# EAGLE design brain_rev_1 (EAGLE 6.3)
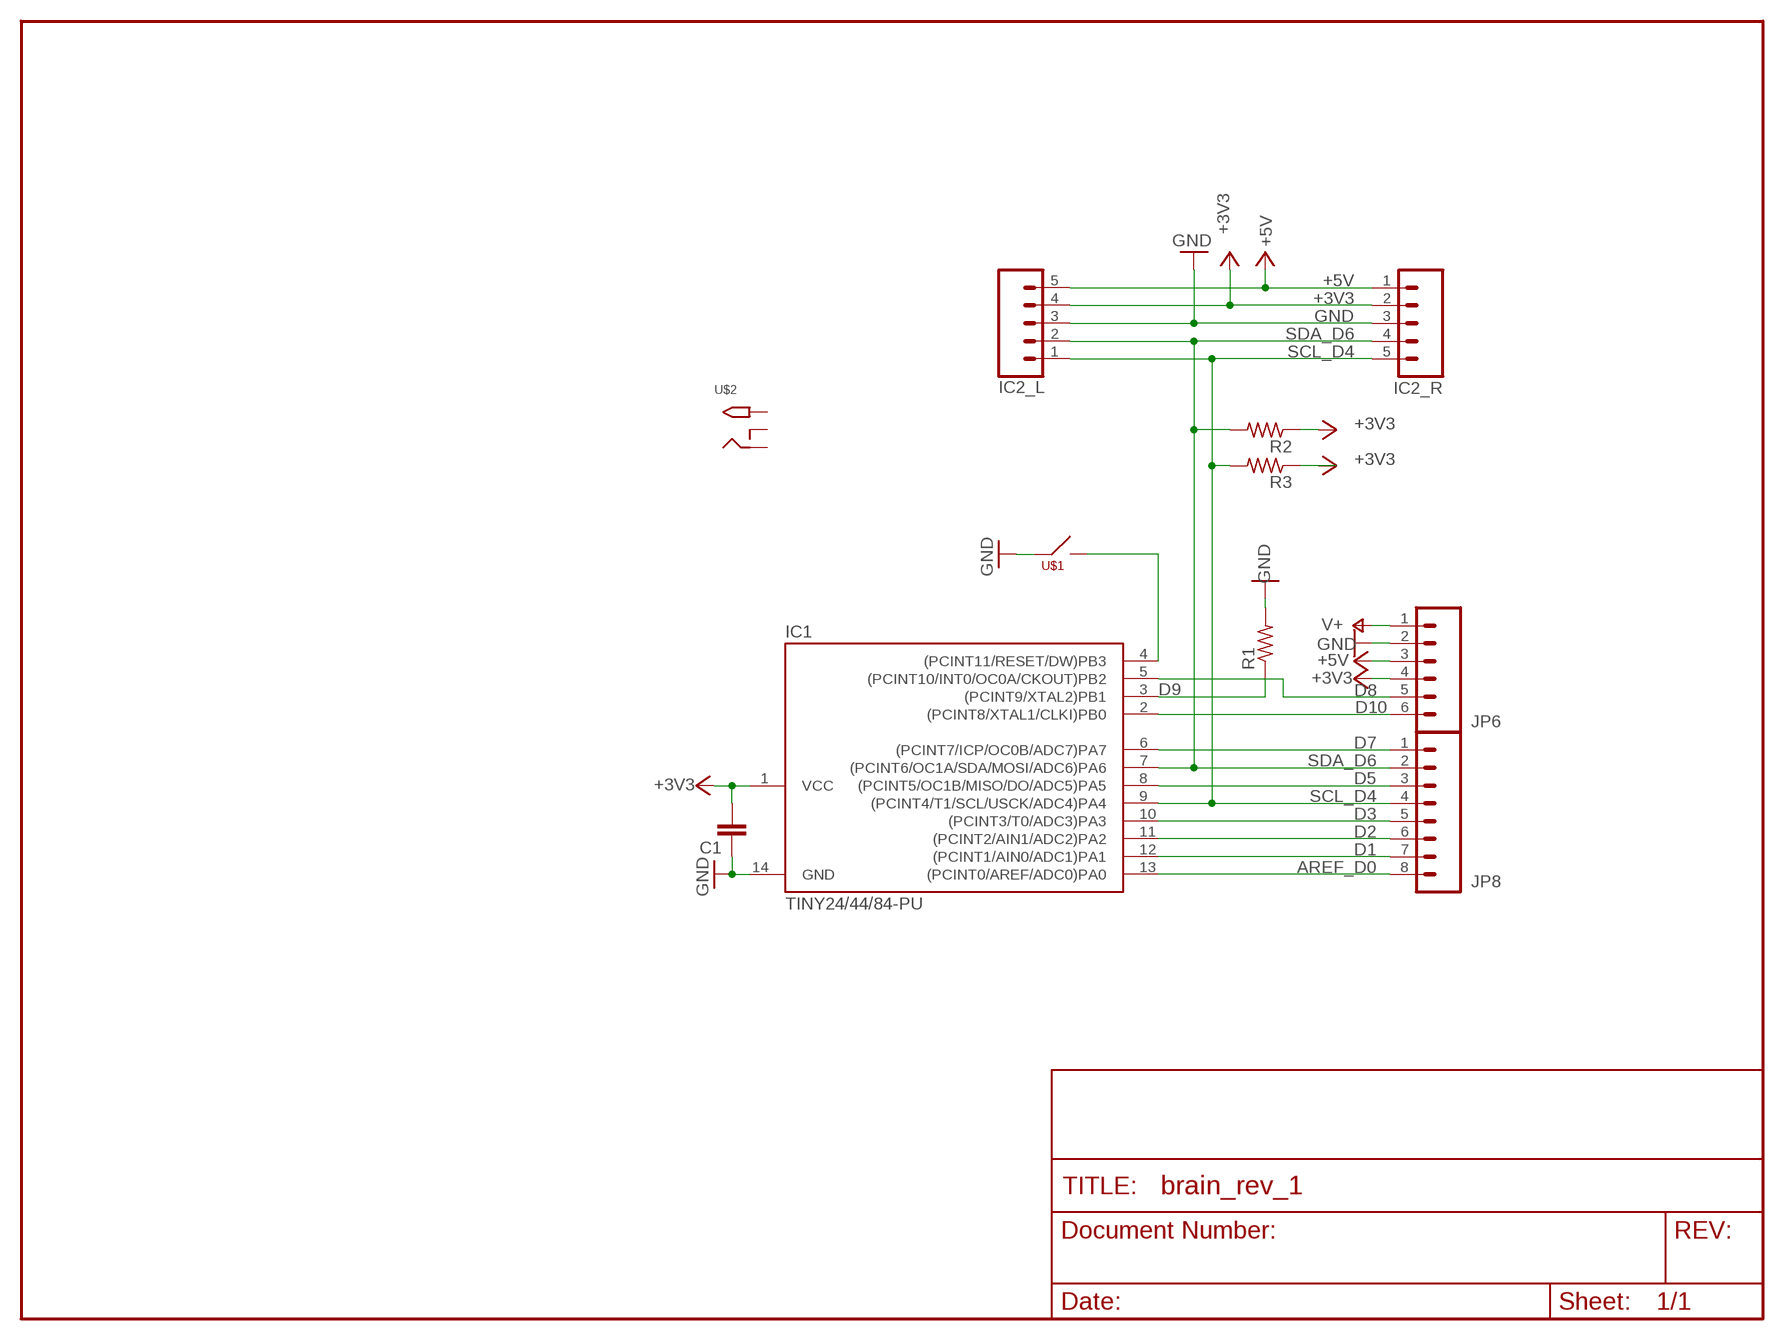
[diagram p0: schematic, sheet 1]

## Parts
C1  CAPKIT  [CAP-PTH-SMALL-KIT]
IC1  TINY24/44/84-PU  [DIL14]
IC2_L  M05PTH  [1X05]
IC2_R  M05PTH  [1X05]
JP6  M06SIP  [1X06]
JP8  M081X08  [1X08]
R1  R-US_0204/2V  [0204V]
R2  R-US_0204/2V  [0204V]
R3  R-US_0204/2V  [0204V]
U$1  PTS635_SWITCH  [PTS635_SWITCH]
U$2  2.1MMJACKTHM  [PJ-102A]

## Nets
+3V3: C1.2 IC1.1(VCC) IC2_L.4 IC2_R.2 JP6.4 R2.1 R3.1
+5V: IC2_L.5 IC2_R.1 JP6.3
AREF_D0: IC1.13((PCINT0/AREF/ADC0)PA0) JP8.8
D1: IC1.12((PCINT1/AIN0/ADC1)PA1) JP8.7
D2: IC1.11((PCINT2/AIN1/ADC2)PA2) JP8.6
D3: IC1.10((PCINT3/T0/ADC3)PA3) JP8.5
D5: IC1.8((PCINT5/OC1B/MISO/DO/ADC5)PA5) JP8.3
D7: IC1.6((PCINT7/ICP/OC0B/ADC7)PA7) JP8.1
D8: IC1.5((PCINT10/INT0/OC0A/CKOUT)PB2) JP6.5
D9: IC1.3((PCINT9/XTAL2)PB1) R1.1
D10: IC1.2((PCINT8/XTAL1/CLKI)PB0) JP6.6
GND: C1.1 IC1.14(GND) IC2_L.3 IC2_R.3 JP6.2 R1.2 U$1.P$1
RESET: IC1.4((PCINT11/RESET/DW)PB3) U$1.P$2
SCL_D4: IC1.9((PCINT4/T1/SCL/USCK/ADC4)PA4) IC2_L.1 IC2_R.5 JP8.4 R3.2
SDA_D6: IC1.7((PCINT6/OC1A/SDA/MOSI/ADC6)PA6) IC2_L.2 IC2_R.4 JP8.2 R2.2
V+: JP6.1
Unconnected: U$2.RING U$2.RING_SW U$2.TIP

## Library data of the parts
C1 = SparkFun:CAP: Capacitor Standard 0603 ceramic capacitor, and 0.1" leaded capacitor.
IC1 = avr-7:TINY24/44/84
IC2_L IC2_R = SparkFun_mod:M05: Header 5 Standard 5-pin 0.1" header. Use with straight break away headers (SKU : PRT-00116), right angle break away headers (PRT-00553), swiss pins (PRT-00743), machine pins (PRT-00117), and female headers (PRT-00115). Molex polarized connector foot print use with SKU : PRT-08230 with associated crimp pins and housings.
JP6 = SparkFun:M06: Header 6 Standard 6-pin 0.1" header. Use with straight break away headers (SKU : PRT-00116), right angle break away headers (PRT-00553), swiss pins (PRT-00743), machine pins (PRT-00117), and female headers (PRT-00115). Molex polarized connector foot print use with SKU : PRT-08094 with associated crimp pins and housings. NOTES ON THE VARIANTS LOCK and LOCK_LONGPADS... This footprint was designed to help hold the alignment of a through-hole component (i.e. 6-pin header) while soldering it into place. You may notice that each hole has been shifted either up or down by 0.005 of an inch from it's more standard position (which is a perfectly straight line). This slight alteration caused the pins (the squares in the middle) to touch the edges of the holes. Because they are alternating, it causes a "brace" to hold the component in place. 0.005 has proven to be the perfect amount of "off-center" position when using our standard breakaway headers. Although looks a little odd when you look at the bare footprint, once you have a header in there, the alteration is very hard to notice. Also, if you push a header all the way into place, it is covered up entirely on the bottom side. This idea of altering the position of holes to aid alignment will be further integrated into the Sparkfun Library for other footprints. It can help hold any component with 3 or more connection pins.
JP8 = SparkFun:M08: Header 8 Standard 8-pin 0.1" header. Use with straight break away headers (SKU : PRT-00116), right angle break away headers (PRT-00553), swiss pins (PRT-00743), machine pins (PRT-00117), and female headers (PRT-00115).
R1-R3 = adafruit_mod:R-US_: RESISTOR, American symbol
U$1 = _my-parts:PTS635_SWITCH: www.ck-components.com
U$2 = adafruit:2.1MMJACK: 2.1mm x 5.5mm THM DC jack with internal switch. Digikey part #PJ-102A, 4UCON part #05537 2.1mm x 5.5mm SMT DC jack with internal switch. Digikey part #PJ-002A-SMT, 4UCON part #03267 By microbuilder.eu & adafruit.com

## Board
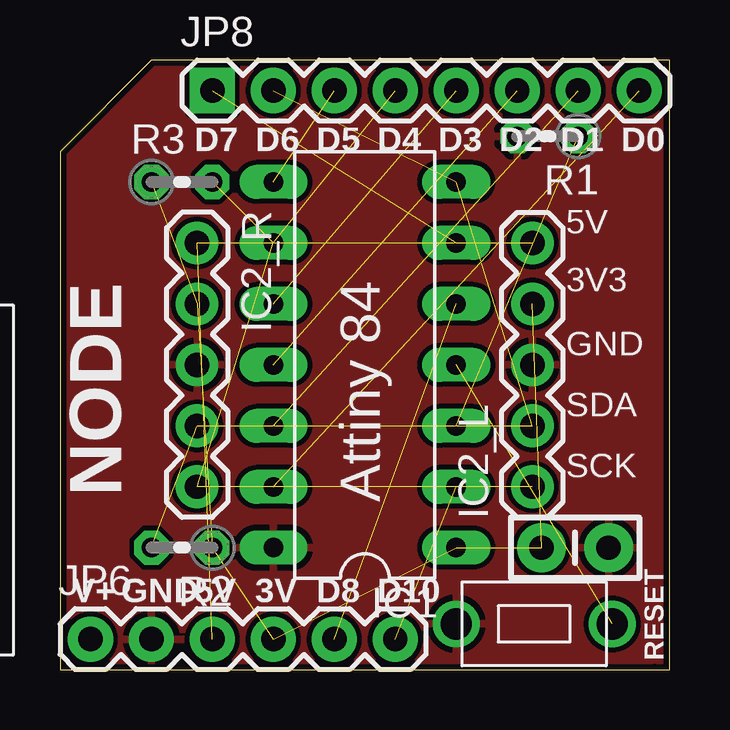
[diagram p1: board, top side]
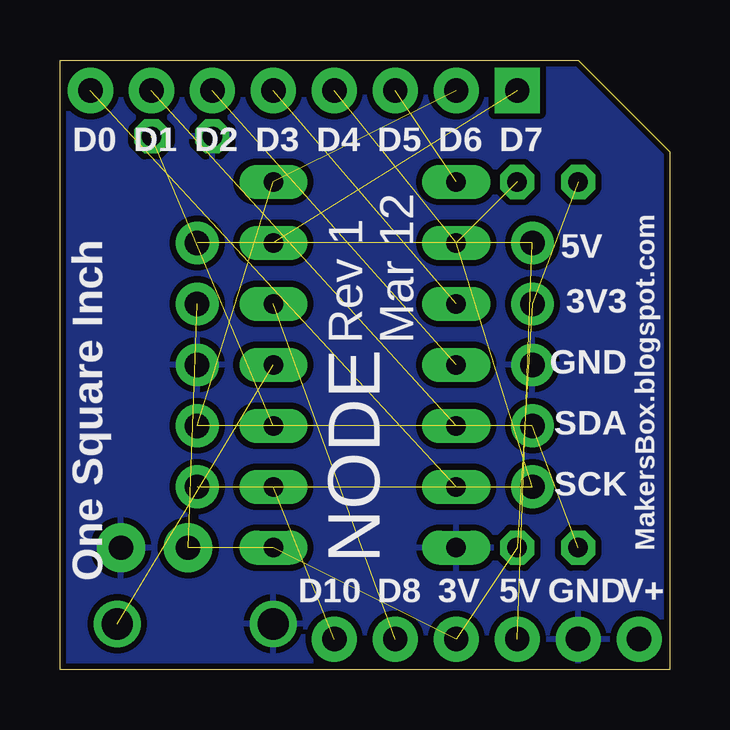
[diagram p2: board, bottom side, seen from below]

Size 25.4 x 25.4 mm. Coordinates in mm from the lower left corner, seen from the top.
Outline: 25.4,25.4 25.4,21.59 25.4,0 24.77,0 24.77,0 0,0 0,21.59
Outline: 25.4,25.4 3.81,25.4 0,21.59
Outline: 0,21.59 0,21.59
Copper layers (1*16): Top 0.035mm / dielectric 1.5mm / Bottom 0.035mm
Design rules "SparkFun": minimum track width 8mil, minimum drill 20mil, track to track 8mil, track to pad 8mil, pad to pad 8mil, via to via 8mil, smd to smd 8mil, copper to edge 10mil, drill to drill 8mil, minimum pad ring 12mil, minimum via ring 10mil, stop-mask expansion 4mil, vias tented up to drill 25mil, thermal gap 10mil

### Footprints (pad centres in the part's own frame; a part is rotated, then mirrored left to right if it is on the bottom)
CAP-PTH-SMALL-KIT = drill 1.016 pad 2.032: 1 -1.397,0; 2 1.397,0
DIL14 = drill 0.813 long: 1 -7.62,-3.81; 2 -5.08,-3.81; 3 -2.54,-3.81; 4 0,-3.81; 5 2.54,-3.81; 6 5.08,-3.81; 7 7.62,-3.81; 8 7.62,3.81; 9 5.08,3.81; 10 2.54,3.81; 11 0,3.81; 12 -2.54,3.81; 13 -5.08,3.81; 14 -7.62,3.81
1X05 = drill 1.016 pad 1.778: 1 0,0; 2 2.54,0; 3 5.08,0; 4 7.62,0; 5 10.16,0
1X06 = drill 1.016 pad 1.88: 1 0,0; 2 2.54,0; 3 5.08,0; 4 7.62,0; 5 10.16,0; 6 12.7,0
1X08 = drill 1.016 pad 1.88 square: 1 0,0 | drill 1.016 pad 1.88: 2 2.54,0; 3 5.08,0; 4 7.62,0; 5 10.16,0; 6 12.7,0; 7 15.24,0; 8 17.78,0
0204V = drill 0.813 octagon: 1 -1.27,0; 2 1.27,0
PTS635_SWITCH = drill 1.3: P$1 0,0; P$2 6.5,0
PJ-102A = drill 3 pad 4.8: RING 0.1,-3.39; RING_SW -4.6,-6.29; TIP 0.1,-9.29

### Placement (x,y rotation side)
C1  21.46,5.08 180 top
IC1  12.7,12.7 90 top
IC2_L  19.68,7.62 90 top
IC2_R  5.71,17.78 270 top
JP6  1.27,1.27 0 top
JP8  6.35,24.13 0 top
R1  20.32,22.23 180 top
R2  5.08,5.08 180 top
R3  5.08,20.32 0 top
U$1  16.51,1.91 0 top
U$2  -6.35,10.79 0 top  (outside the outline)

### Tracks (layer width: path | path; a pad name or v marks a point on that pad's centre or on a via)
+3V3  (6 unrouted)
+5V  (2 unrouted)
AREF_D0  (1 unrouted)
D1  (1 unrouted)
D2  (1 unrouted)
D3  (1 unrouted)
D5  (1 unrouted)
D7  (1 unrouted)
D8  (1 unrouted)
D9  (1 unrouted)
D10  (1 unrouted)
GND
  pour Bottom (isolate 0.254): -1.27,26.67 26.67,26.67 26.67,-1.27 -1.27,-1.27
  pour Top: -0.64,26.04 26.67,26.04 26.67,0 26.04,-0.64 -0.64,-0.64
RESET  (1 unrouted)
SCL_D4  (4 unrouted)
SDA_D6  (4 unrouted)

### Text on the board
tPlace: D7 | D6 | D5 | D4 | D3 | D2 | D1 | D0 | 5V | NODE | 3V3 | GND | SDA | SCK | Attiny 84 | V+ | GND | 5V | 3V | D8 | D10 | RESET
bPlace: D7 | D6 | D5 | D4 | D3 | D2 | D1 | D0 | 5V | 3V3 | Rev 1 / Mar 12 | GND | SDA | SCK | MakersBox.blogspot.com | NODE | One Square Inch | V+ | GND | 5V | 3V | D8 | D10